# Altium schematic sheet Main.SchDoc
size A4; DocumentNumber: 1; SheetNumber: 1
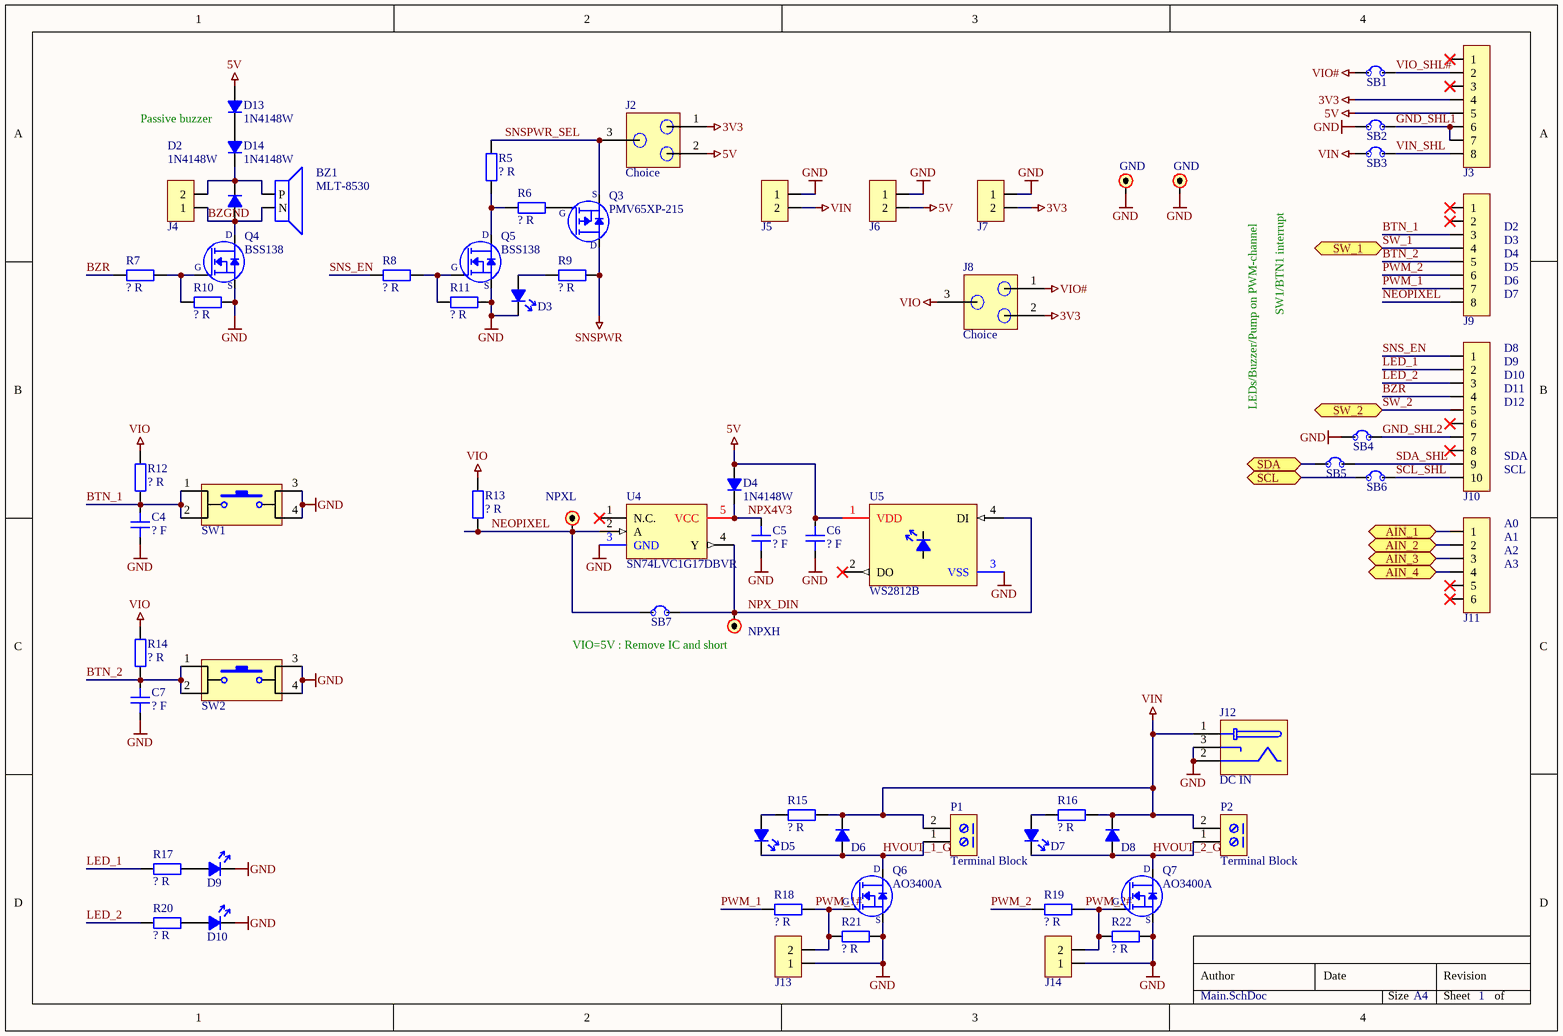
[diagram p0: Main.SchDoc]

## Parts
BZ1  MLT-8530  [MLT-8530]
C4  ? F  [0603C_RF_M]
C5  ? F  [0603C_RF_M]
C6  ? F  [0603C_RF_M]
C7  ? F  [0603C_RF_M]
D2  1N4148W  [D_SOD-123]
D3  Unspecified  [0805LED_RF_M]  (value not drawn)
D4  1N4148W  [D_SOD-123]
D5  Unspecified  [0805LED_RF_M]  (value not drawn)
D6  D  [ONSEMI_DO214AC_RF_M]  (value not drawn)
D7  Unspecified  [0805LED_RF_M]  (value not drawn)
D8  D  [ONSEMI_DO214AC_RF_M]  (value not drawn)
D9  Unspecified  [0805LED_RF_M]  (value not drawn)
D10  Unspecified  [0805LED_RF_M]  (value not drawn)
D13  1N4148W  [D_SOD-123]
D14  1N4148W  [D_SOD-123]
J2  Choice  [CHOICE_R0805_TR]
J3  PINHDR-8P1  [PINHDR-8P1-2.54]  (value not drawn)
J4  PINHDR-2P1  [HEADER-2.54-2P1]  (value not drawn)
J5  PINHDR-2P1  [HEADER-2.54-2P1]  (value not drawn)
J6  PINHDR-2P1  [HEADER-2.54-2P1]  (value not drawn)
J7  PINHDR-2P1  [HEADER-2.54-2P1]  (value not drawn)
J8  Choice  [CHOICE_R0805_TR]
J9  PINHDR-8P1  [PINHDR-8P1-2.54]  (value not drawn)
J10  PINHDR-10P1  [HEADER-2.54-10P1]  (value not drawn)
J11  PINHDR-6P1  [HEADER-2.54-6P1]  (value not drawn)
J12  DC IN  [CON JACK PWR 2.5mm PJ-002BH - duplicate]
J13  PINHDR-2P1  [HEADER-2.54-2P1]  (value not drawn)
J14  PINHDR-2P1  [HEADER-2.54-2P1]  (value not drawn)
P1  Terminal Block  [KF128-2P]
P2  Terminal Block  [KF128-2P]
Q3  PMV65XP-215  [IRLML_SOT-23]
Q4  BSS138  [IRLML_SOT-23]
Q5  BSS138  [IRLML_SOT-23]
Q6  AO3400A  [IRLML_SOT-23]
Q7  AO3400A  [IRLML_SOT-23]
R5  ? R  [R0603_RF_M]
R6  ? R  [R0603_RF_M]
R7  ? R  [R0603_RF_M]
R8  ? R  [R0603_RF_M]
R9  ? R  [R0603_RF_M]
R10  ? R  [R0603_RF_M]
R11  ? R  [R0603_RF_M]
R12  ? R  [R0603_RF_M]
R13  ? R  [R0603_RF_M]
R14  ? R  [R0603_RF_M]
R15  ? R  [R0603_RF_M]
R16  ? R  [R0603_RF_M]
R17  ? R  [R0603_RF_M]
R18  ? R  [R0603_RF_M]
R19  ? R  [R0603_RF_M]
R20  ? R  [R0603_RF_M]
R21  ? R  [R0603_RF_M]
R22  ? R  [R0603_RF_M]
SB1  Solder Bridge  [SLDR_BRDG_0603_OPEN]  (value not drawn)
SB2  Solder Bridge  [SLDR_BRDG_0603_OPEN]  (value not drawn)
SB3  Solder Bridge  [SLDR_BRDG_0603_OPEN]  (value not drawn)
SB4  Solder Bridge  [SLDR_BRDG_0603_OPEN]  (value not drawn)
SB5  Solder Bridge  [SLDR_BRDG_0603_OPEN]  (value not drawn)
SB6  Solder Bridge  [SLDR_BRDG_0603_OPEN]  (value not drawn)
SB7  Solder Bridge  [SLDR_BRDG_0603_OPEN]  (value not drawn)
SW1  BTN-SPST-NO-4C  [SW_TL3305AF160QG]  (value not drawn)
SW2  BTN-SPST-NO-4C  [SW_TL3305AF160QG]  (value not drawn)
TP5  GND  [PAD_R_1.5MM]
TP6  GND  [PAD_R_1.5MM]
TP7  NPXL  [PAD_R_1MM]
TP8  NPXH  [PAD_R_1MM]
U4  SN74LVC1G17DBVR  [TI_SOT-23-5]
U5  WS2812B  [WS2812B]

## Ports
AIN_1, AIN_2, AIN_3, AIN_4, SCL, SDA, SW_1, SW_2

## Nets
3V3: J2.1 J3.4 J7.2 J8.2
5V: C6.1 D4.A D13.A J2.2 J3.5 J6.2 U5.1(VDD)
GND: C4.1 C5.2 C6.2 C7.1 D3.C D9.C D10.C J5.1 J6.1 J7.1 J12.2 J12.3 J13.1 J14.1 Q4.2(S) Q5.2(S) Q6.2(S) Q7.2(S) R10.1 R11.1 R21.1 R22.1 SB2.1 SB4.1 SW1.3 SW1.4 SW2.3 SW2.4 TP5.1 TP6.1 U4.3(GND) U5.3(VSS)
SNSPWR: Q3.3(Drain) R9.2
VIN: D6.C D8.C J5.2 J12.1 P1.2 P2.2 R15.2 R16.2 SB3.1
VIO: J8.3 R12.2 R13.1 R14.2
VIO#: J8.1 SB1.1
AIN_1: J11.1 ; port AIN_1
AIN_2: J11.2 ; port AIN_2
AIN_3: J11.3 ; port AIN_3
AIN_4: J11.4 ; port AIN_4
BTN_1: C4.2 J9.3 R12.1 SW1.1 SW1.2
BTN_2: C7.2 J9.5 R14.1 SW2.1 SW2.2
BZGND: BZ1.N D2.A J4.1 Q4.3(D)
BZR: J10.4 R7.1
GND_SHL1: J3.6 J3.7 SB2.2
GND_SHL2: J10.7 SB4.2
HVOUT_1_GND: D5.C D6.A P1.1 Q6.3(D)
HVOUT_2_GND: D7.C D8.A P2.1 Q7.3(D)
LED_1: J10.2 R17.1
LED_2: J10.3 R20.1
NEOPIXEL: J9.8 R13.2 SB7.1 TP7.1 U4.2(A)
NPX4V3: C5.1 D4.C U4.5(VCC)
NPX_DIN: SB7.2 TP8.1 U4.4(Y) U5.4(DI)
PWM_1: J9.7 R18.1
PWM_1#: J13.2 Q6.1(G) R18.2 R21.2
PWM_2: J9.6 R19.1
PWM_2#: J14.2 Q7.1(G) R19.2 R22.2
SCL: SB6.1 ; port SCL
SCL_SHL: J10.10 SB6.2
SDA: SB5.1 ; port SDA
SDA_SHL: J10.9 SB5.2
SNS_EN: J10.1 R8.1
SNSPWR_SEL: J2.3 Q3.2(Source) R5.1
SW_1: J9.4 ; port SW_1
SW_2: J10.5 ; port SW_2
VIN_SHL: J3.8 SB3.2
VIO_SHL#: J3.2 SB1.2
NetBZ1_P: BZ1.P D2.C D14.C J4.2
NetD3_A: D3.A R9.1
NetD5_A: D5.A R15.1
NetD7_A: D7.A R16.1
NetD9_A: D9.A R17.2
NetD10_A: D10.A R20.2
NetD13_C: D13.C D14.A
NetQ3_1: Q3.1(Gate) R6.2
NetQ4_1: Q4.1(G) R7.2 R10.2
NetQ5_1: Q5.1(G) R8.2 R11.2
NetQ5_3: Q5.3(D) R5.2 R6.1

Not connected (* = marked no-connect by the designer): J3 1* 3*; J9 1* 2*; J10 6* 8*; J11 5* 6*; U4 1(N.C.)*; U5 2(DO)*

## Notes on the sheet
- Passive buzzer
- (near J9) D2
- (near J9) D3
- SW1/BTN1 interrupt
- (near J9) D4
- (near J9) D5
- (near J9) D6
- (near J9) D7
- D8
- (near J10) D9
- (near J10) D10
- LEDs/Buzzer/Pump on PWM-channel
- (near J10) D11
- (near J10) D12
- (near J10) SDA
- (near J10) SCL
- A0
- (near J11) A1
- (near J11) A2
- (near J11) A3
- (near TP8) VIO=5V : Remove IC and short
- Author
- Date
- Revision
- Size
- A4
- Sheet
- of
- (in symbol PMV65XP-215) S; G; D

## Library data of the parts
BZ1 = MLT-8530: Magnetic Buzzer SMD 8.5x3.3 Passive 2.5V~4.5V; Manufacturer: Jiangsu Huaneng Elec; Rated Voltage: 3.6 V; Resonant Frequency: 2700 Hz; Supplier Link: https://www.lcsc.com/mobile/product-detail/Buzzers_Jiangsu-Huaneng-Elec-MLT-8530_C94599.html; Supplier: LCSC; Alternative Supplier Link: https://www.aliexpress.ru/item/1005003620291811.html; Mounting Technology: SMT; Category: Buzzer
C4-C7 = C: Capacitor; Manufacturer: Generic Brand; Max Voltage: ? V; Value: ? F; Tolerance: ?; Mounting Technology: SMT; Tag: *; Manufacturer Part No: *; Supplier: *; Supplier Link: http://; Supplier Part No: *; Category: Capacitor
D2 D4 D13 D14 = 1N4148W: DIODE GEN PURP 100V 300MA SOD123; Similar Part: BAV16W; Manufacturer: Diodes Incorporated; Manufacturer Product Number: 1N4148W-7-F; Supplier Part No: 1N4148W-FDICT-ND; Supplier URL: https://www.digikey.com/en/products/detail/diodes-incorporated/1N4148W-7-F/814371; Mounting Technology: SMT; Package: SOD-123
D3 D5 D7 D9 D10 = LED: Manufacturer: Generic Brand; Forward Voltage Drop: ? V; Emitting Color: Unspecified; Manufacturer Part No: *; Supplier: *; Supplier Link: http://; Supplier Part No: *; Category: Diode; Mounting Technology: SMT
D6 D8 = D: Diode (Rectifier); Manufacturer: Generic Brand; Max Forward Voltage: ? V; Power Rating: ? W; Manufacturer Part No: *; Supplier: *; Supplier Link: http://; Supplier Part No: *; Mounting Technology: SMT; Category: Diode
J3 J9 = PINHDR-8P1: Pin Header Single Row 8 Positions; Mounting Technology: THT
J4-J7 J13 J14 = PINHDR-2P1: Pin Header Single Row 2 Positions; Mounting Technology: THT
J10 = PINHDR-10P1: Generic Pin Header 10x1
J11 = PINHDR-6P1: Pin Header Single Row 6 Positions; Mounting Technology: THT
J12 = PJ-002BH: CONN PWR JACK 2.5X5.5MM SOLDER; Manufacturer: CUI Devices; PartNo: CP-002BH-ND; Supplier: DigiKey; ProductNumber: PJ-002BH; URL: https://www.digikey.com/en/products/detail/cui-devices/PJ-002BH/408447; UnitPrice: $0.74; MountType: THT
P1 P2 = TERM-BLOCK-2C
Q3 = PMV65XP-215: MOSFET P-CH 20V 2.8A 23SOT; Gate-Source Threshold Voltage: -0.69V (typ.); Drain-Source Breakdown Voltage: -20V; Drain Current: -2.8A (max.); Max Gate-Source Voltage: 12V (abs.); Supplier Part No: 1727-3124-1-ND; Supplier: DigiKey; Supplier Link: https://www.digikey.com/en/products/detail/nexperia-usa-inc/PMV65XP-215/949643; Mounting Technology: SMT; Package: SOT-23; Alternative Supplier: Chipdip; Alternative Supplier Link: https://www.chipdip.by/product/pmv65xp.215; Alternative Supplier Part No: 9000037397
Q4 Q5 = BSS138: MOSFET N-CH 50V 200MA SOT23; Manufacturer: ON Semiconductor; Manufacturer Part No: BSS138LT1G; Supplier: DigiKey; Supplier Link: https://www.digikey.com/en/products/detail/on-semiconductor/BSS138L/5044751; Supplier Part No: BSS138LCT-ND; Mounting Technology: SMT; Package: SOT-23; Alternative Supplier: Chipdip; Alternative Supplier Part No: 457167271; Alternative Supplier Link: https://www.chipdip.by/product/bss138-onsemi
Q6 Q7 = AO3400A: MOSFET N-CH 30V 5.7A SOT23-3L; Manufacturer: Alpha & Omega; Manufacturer Part No: AO3400A; Supplier: AliExpress; Supplier Link: https://aliexpress.ru/item/1626916488.html; Supplier Part No: 1626916488; Mounting Technology: SMT; Package: SOT-23-3L
R5-R22 = R: Resistor; Manufacturer: Generic Brand; Power Rating: ? W; Max Voltage: ? V; Value: ? R; Tolerance: ?; Supplier Link: http://; Category: Resistor; Mounting Technology: SMT
SW1 SW2 = BTN-SPST-NO-4C: Tactile Switch SPST-NO; Manufacturer: Generic Brand; Category: Tactile Button; Mounting Technology: THT; Supplier Link: http://
TP5-TP8 = Test Point: Test Point / Pad
U4 = SN74LVC1G17DBVR: IC BUF NON-INVERT 5.5V SOT23-5; Manufacturer: Texas Instruments; Supplier Part No: 296-11933-1-ND; Supplier URL: https://www.digikey.com/en/products/detail/texas-instruments/SN74LVC1G17DBVR/389051; Supplier Unit Price: $0.29; Supplier Packaging: Cut Tape; Manufacturer Product Number: SN74LVC1G17DBVR; Operating Temperature: -40°C ~ 125°C (TA); Mounting Type: SMT; Package: SOT-23-5
U5 = WS2812B: ADDRESS LED DISCRETE SERIAL RGB; Manufacturer: Worldsemi